# Altium schematic sheet Sheet5.SchDoc
size A4
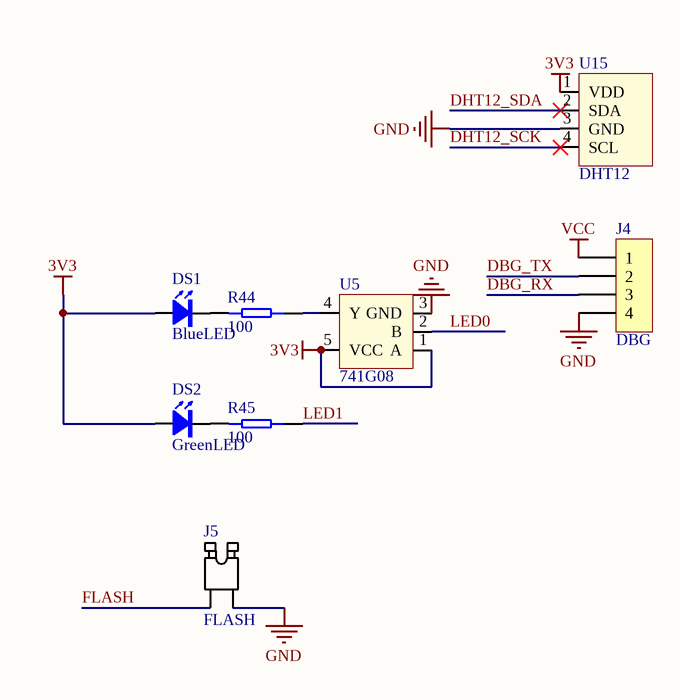
[diagram p0: Sheet5.SchDoc]

## Parts
DS1  BlueLED  [LED-5]
DS2  GreenLED  [LED-5]
J4  DBG  [SIP4-2.54]
J5  FLASH  [CN2]
R44  100  [0402R]
R45  100  [0402R]
U5  741G08  [LC-SOT-23-5]
U15  DHT12  [DHT12]

## Nets
3V3: DS1.A DS2.A U5.1(A) U5.5(VCC) U15.1(VDD)
GND: J4.4 J5.2 U5.3(GND) U15.3(GND)
VCC: J4.1
DBG_RX: J4.3
DBG_TX: J4.2
DHT12_SCK: U15.4(SCL)
DHT12_SDA: U15.2(SDA)
FLASH: J5.1
LED0: U5.2(B)
LED1: R45.2
NetDS1_K: DS1.K R44.1
NetDS2_K: DS2.K R45.1
NetR44_2: R44.2 U5.4(Y)

## Library data of the parts
DS1 = LED: Blue LED
DS2 = LED: Green LED
J4 = SIP4: jointbar
J5 = CN2
R44 R45 = R
U5 = 741G08: SN74AHC1G08DBVR